# EasyEDA Pro project ASTROPET_SENSOR_SOURCE.epro, schematic sensor module
Board Name: outdoors; Create Date: 2026-06-01; Page Name: P1; Project Name: light pollution thingy; Schematic Name: sensor module; Update Date: 2026-06-05; Company: EasyEDA.com; Page Size: A4; Version: V1.0
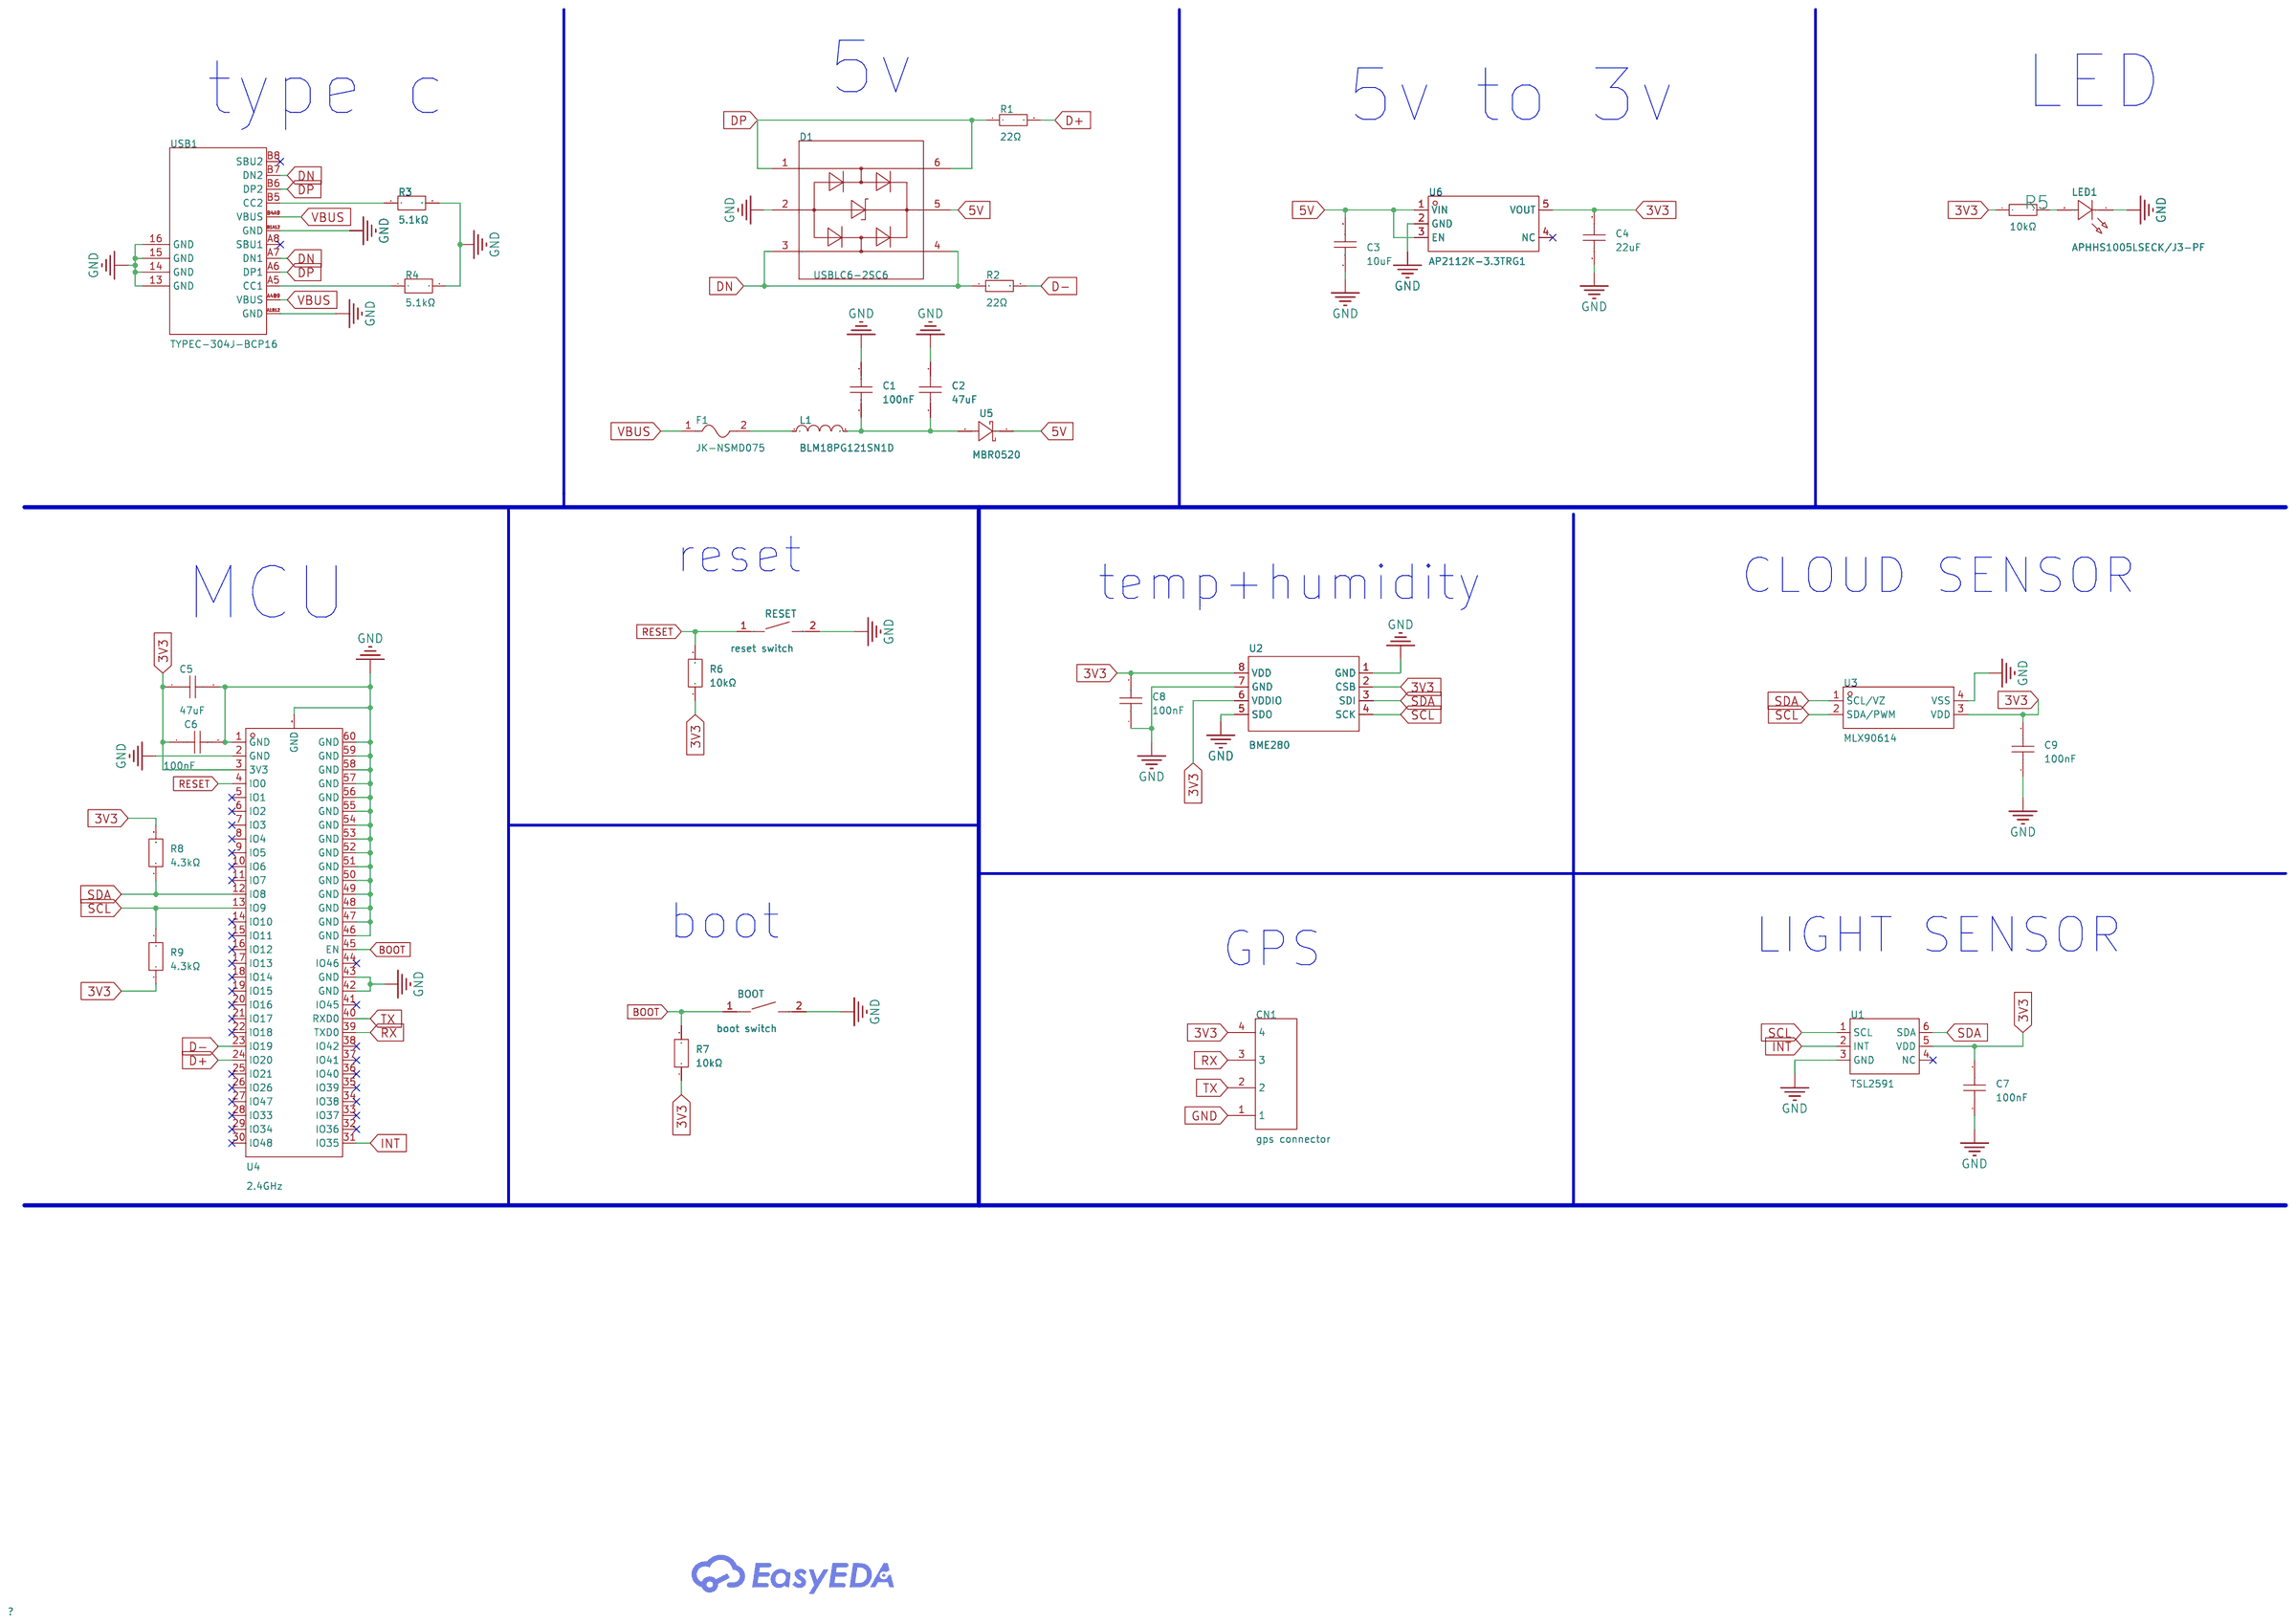
[diagram p1: schematic sheet]

## Parts
BOOT  boot switch  [SW-SMD_L3.9-W3.0-P4.45]
C1  100nF  [C0603]
C2  47uF  [C0805]
C3  10uF  [C0805]
C4  22uF  [C0805]
C5  47uF  [C0805]
C6  100nF  [C0603]
C7  100nF  [C0603]
C8  100nF  [C0603]
C9  100nF  [C0603]
CN1  gps connector  [CONN-TH_B4B-PH-K-S]
D1  USBLC6-2SC6  [SOT-23-6_L2.9-W1.6-P0.95-LS2.8-BL]
F1  JK-NSMD075  [F1206]
L1  BLM18PG121SN1D  [L0603]
LED1  APHHS1005LSECK/J3-PF  [LED0402-RD_RED]
R1  22Ω  [R0603]
R2  22Ω  [R0603]
R3  5.1kΩ  [R0603]
R4  5.1kΩ  [R0603]
R5  10kΩ  [R0603]
R6  10kΩ  [R0603]
R7  10kΩ  [R0603]
R8  4.3kΩ  [R0603]
R9  4.3kΩ  [R0603]
RESET  reset switch  [SW-SMD_L3.9-W3.0-P4.45]
U1  TSL2591  [DFN-6_L2.4-W2.0-P0.65-BL]
U2  BME280  [LGA-8_BME280_BL]
U3  MLX90614  [TO-39-4_MELEXIS_MLX90614XXA]
U4  2.4GHz  [BULETM-SMD_ESP32-S3-MINI-1-N8]
U5  MBR0520  [SOD-123_L2.7-W1.6-LS3.7-RD-A]
U6  AP2112K-3.3TRG1  [SOT-25-5_L2.9-W1.6-P0.95-LS2.8-BL]
USB1  TYPEC-304J-BCP16  [USB-C-SMD_TYPEC-304J-BCP16]

## Library data of the parts
BOOT RESET = TS-1088-AR02016: Circuit:SPST Actuator Style:Round Button Operating Force:1.6N Mounting Type:Surface Mount,Vertical Length:4mm Width:3mm Switch Height:2mm with Bracket:Without Bracket Contact Current:50mA Voltage Rating:12V Actuator/Cap Color:Black Termination Style:SMD(S; LCSC Part Name: 4*3*2mm 立贴 轻触开关; Supplier Part: C720477; Manufacturer: XUNPU(讯普); Supplier Footprint: SMD,4x3mm; JLCPCB Part Class: Basic Part; Datasheet: https://item.szlcsc.com/datasheet/TS-1088-AR02016/763484.html; Supplier: LCSC; Circuit: SPST; Actuator Style: Round Button; Operating Force: 1.6N; Mounting Type: Surface Mount,Vertical; Length: 4mm; Width: 3mm; Switch Height: 2mm; with Bracket: Without Bracket; Contact Current: 50mA; Voltage Rating: 12V; Actuator/Cap Color: Black; Termination Style: SMD(SMT) Tab; Life: 100,000 Cycles; Operating Temperature: -30℃~+80℃
C1 C6-C9 = CC0603KRX7R9BB104: Capacitance:100nF Tolerance:±10% Tolerance:±10% Voltage Rating:50V Temperature Coefficient:X7R; LCSC Part Name: 100nF ±10% 50V; Supplier Part: C14663; Manufacturer: YAGEO(国巨); Supplier Footprint: 0603; Datasheet: https://item.szlcsc.com/datasheet/CC0603KRX7R9BB104/15331.html; Supplier: LCSC; Tolerance: ±10%; Voltage Rating: 50V; Temperature Coefficient: X7R
C2 C5 = CGA0805X5R476M100MT: Capacitance:47uF Tolerance:±20% Tolerance:±20% Voltage Rating:10V Temperature Coefficient:X5R; LCSC Part Name: 47uF ±20% 10V; Supplier Part: C6119904; Manufacturer: HRE(芯声); Supplier Footprint: 0805; JLCPCB Part Class: Extended Part; Datasheet: https://item.szlcsc.com/datasheet/CGA0805X5R476M100MT/7062610.html; Supplier: LCSC; Tolerance: ±20%; Voltage Rating: 10V; Temperature Coefficient: X5R
C3 = CL21A106KAYNNNE_C15850: Capacitance:10uF Tolerance:±10% Tolerance:±10% Voltage Rating:25V Temperature Coefficient:X5R; LCSC Part Name: 10uF ±10% 25V; Supplier Part: C15850; Manufacturer: SAMSUNG(三星); Manufacturer Part: CL21A106KAYNNNE; Supplier Footprint: 0805; JLCPCB Part Class: Basic Part; Datasheet: https://item.szlcsc.com/datasheet/CL21A106KAYNNNE/16532.html; Supplier: LCSC; Tolerance: ±10%; Voltage Rating: 25V; Temperature Coefficient: X5R
C4 = CL21A226MQQNNNE: Capacitance:22uF Tolerance:±20% Tolerance:±20% Voltage Rating:6.3V Temperature Coefficient:X5R; LCSC Part Name: 22uF ±20% 6.3V; Supplier Part: C5674; Manufacturer: SAMSUNG(三星); Supplier Footprint: 0805; Datasheet: https://item.szlcsc.com/datasheet/CL21A226MQQNNNE/6133.html; Supplier: LCSC; Tolerance: ±20%; Voltage Rating: 6.3V; Temperature Coefficient: X5R
CN1 = B4B-PH-K-S(LF)(SN)_C131334: Pins Structure:1x4P Pitch:2mm Mounting Type:Through Hole Reference Series:PH Number of Pins:4P Number of Rows:1 Number of PINs Per Row:4 Row Spacing:- Current Rating:2A Contact Material:Brass Contact Plating:Tin Operating Temperature:-25℃~+85℃ Operating T; LCSC Part Name: 1x4P 间距:2mm 直插 系列:PH; Supplier Part: C131334; Manufacturer: JST; Supplier Footprint: 插件,P=2mm; Datasheet: https://item.szlcsc.com/datasheet/B4B-PH-K-S(LF)(SN)/142627.html; Supplier: LCSC; Pins Structure: 1x4P; Pitch: 2mm; Mounting Type: Through Hole; Reference Series: PH; Number of Pins: 4P; Number of Rows: 1; Number of PINs Per Row: 4; Current Rating: 2A; Contact Material: Brass; Contact Plating: Tin; Operating Temperature: -25℃~+85℃; Voltage Rating: 100V; Plastic Material: PA66; Flame Retardant Rating: UL94V-0; Supplementary Features: K Pin; Color: White; Z-Height of the Board: 6mm; X-Length of Bottom Edge on Board (Spacing Line): 9.9mm; Y-Width of Bottom Edge on Board: 4.5mm
D1 = USBLC6-2SC6_C7519: Polarity:Unidirectional Reverse Stand-Off Voltage (Vrwm):5.25V Clamping Voltage:17V Peak Pulse Current (Ipp):5A Voltage - Breakdown:6V Reverse Leakage Current (Ir):150nA Number of Channels:2 Operating Temperature:-40℃~+125℃ Operating Temperature:-40℃~+125; LCSC Part Name: 单向ESD; Supplier Part: C7519; Manufacturer: ST(意法半导体); Supplier Footprint: SOT-23-6L; Datasheet: https://item.szlcsc.com/datasheet/USBLC6-2SC6/7996.html; Supplier: LCSC; Polarity: Unidirectional; Reverse Stand-Off Voltage (Vrwm): 5.25V; Clamping Voltage: 17V; Peak Pulse Current (Ipp): 5A; Voltage - Breakdown: 6V; Reverse Leakage Current (Ir): 150nA; Number of Channels: 2; Operating Temperature: -40℃~+125℃; level of protection: IEC 61000-4-2; Type: ESD; Junction Capacitance: 3.5pF
F1 = JK-NSMD075: Voltage - Max:6V Current - Max:100A Hold Current:750mA Trip Current:1.5A Power Dissipation:- Resistance - Initial (Ri) (Min):90mΩ Resistance - Post Trip (R1) (Max):500mΩ Time to Trip(Max):200ms Operating Temperature:-40℃~+85℃ Operating Temperature:-40℃~+8; LCSC Part Name: 6V 750mA 1206自恢复; Supplier Part: C2830242; Manufacturer: JK(金科); Supplier Footprint: 1206; Datasheet: https://item.szlcsc.com/datasheet/JK-NSMD075/726297.html; Supplier: LCSC; Voltage - Max: 6V; Current - Max: 100A; Hold Current: 750mA; Trip Current: 1.5A; Resistance - Initial (Ri) (Min): 90mΩ; Resistance - Post Trip (R1) (Max): 500mΩ; Time to Trip(Max): 200ms; Operating Temperature: -40℃~+85℃; Length: 3.5mm; Width: 1.8mm; Height: 0.85mm
L1 = BLM18PG121SN1D_C14709: Impedance @ Frequency:120Ω@100MHz Tolerance:±25% Tolerance:±25% DC Resistance(DCR):50mΩ Current Rating:2A Number of Circuits:1 Operating Temperature:-55℃~+125℃ Operating Temperature:-55℃~+125℃; LCSC Part Name: 单路 0603磁珠 阻抗120Ω@100MHz; Supplier Part: C14709; Manufacturer: muRata(村田); Supplier Footprint: 0603; JLCPCB Part Class: Basic Part; Datasheet: https://item.szlcsc.com/datasheet/BLM18PG121SN1D/15379.html; Supplier: LCSC; Impedance @ Frequency: 120Ω@100MHz; Tolerance: ±25%; DC Resistance(DCR): 50mΩ; Current Rating: 2A; Number of Circuits: 1; Operating Temperature: -55℃~+125℃
LED1 = APHHS1005LSECK/J3-PF: Lamp Holder Type:- Illumination Color:Red Voltage - Forward(Vf):1.8V Voltage - Forward(Vf):1.8V Power(Watts):84mW Forward Current:2mA Wavelength - Dominant:625nm Wavelength - Dominant:625nm Peak Wavelength:640nm Diode Configuration:Discrete Diode Lens Col; LCSC Part Name: 1.0x0.5 mm贴片式芯片LED灯; Supplier Part: C5354976; Manufacturer: Kingbright(今台); Supplier Footprint: 0402; JLCPCB Part Class: Extended Part; Datasheet: https://item.szlcsc.com/datasheet/APHHS1005LSECK%252FJ3-PF/6154435.html; Supplier: LCSC; Illumination Color: Red; Voltage - Forward(Vf): 1.8V; Power(Watts): 84mW; Forward Current: 2mA; Wavelength - Dominant: 625nm; Peak Wavelength: 640nm; Diode Configuration: Discrete Diode; Lens Color: Water Clear; Luminous Intensity: 80mcd; Viewing Angle: 120°; Operating Temperature: -40℃~+85℃
R1 R2 = 0603WAF220JT5E: Type:Thick Film Resistors Resistance:22Ω Tolerance:±1% Tolerance:±1% Power(Watts): Overload Voltage (Max): Temperature Coefficient:±100ppm/℃ Temperature Coefficient:±100ppm/℃ Operating Temperature Range:-55℃~+155℃ Operating Temperature Range:-55℃~+155℃; LCSC Part Name: 22Ω ±1% 100mW 厚膜电阻; Supplier Part: C23345; Manufacturer: UNI-ROYAL(厚声); Supplier Footprint: 0603; JLCPCB Part Class: Basic Part; Datasheet: https://atta.szlcsc.com/upload/public/pdf/source/20200306/C422600_1E6D84923E4A46A82E41ADD87F860B5C.pdf; Supplier: LCSC; Type: Thick Film Resistors; Tolerance: ±1%; Temperature Coefficient: ±100ppm/℃; Operating Temperature Range: -55℃~+155℃
R3 R4 = FRC0603F5101TS: Type:Thick Film Resistor Resistance:5.1kΩ Tolerance:±1% Tolerance:±1% Power(Watts):100mW Voltage-Supply(Max):75V Temperature Coefficient:±100ppm/℃ Temperature Coefficient:±100ppm/℃ Operating Temperature:-55℃~+155℃ Operating Temperature:-55℃~+155℃; LCSC Part Name: 5.1kΩ ±1% 100mW 厚膜电阻; Supplier Part: C2907044; Manufacturer: FOJAN(富捷); Supplier Footprint: 0603; JLCPCB Part Class: Extended Part; Supplier: LCSC; Type: Thick Film Resistor; Tolerance: ±1%; Power(Watts): 100mW; Voltage-Supply(Max): 75V; Temperature Coefficient: ±100ppm/℃; Operating Temperature: -55℃~+155℃
R5 = 0603WAF1002T5E: Type:Thick Film Resistor Resistance:10kΩ Tolerance:±1% Tolerance:±1% Power(Watts):100mW Voltage-Supply(Max):75V Temperature Coefficient:±100ppm/℃ Temperature Coefficient:±100ppm/℃ Operating Temperature:-55℃~+155℃ Operating Temperature:-55℃~+155℃; LCSC Part Name: 厚膜电阻 10kΩ ±1% 100mW; Supplier Part: C25804; Manufacturer: UNI-ROYAL(厚声); Supplier Footprint: 0603; Datasheet: https://item.szlcsc.com/datasheet/0603WAF1002T5E/26547.html; Supplier: LCSC; Type: Thick Film Resistor; Tolerance: ±1%; Power(Watts): 100mW; Voltage-Supply(Max): 75V; Temperature Coefficient: ±100ppm/℃; Operating Temperature: -55℃~+155℃
R6 R7 = FRC0603J103 TS: Type:Thick Film Resistor Resistance:10kΩ Tolerance:±5% Tolerance:±5% Power(Watts):100mW Voltage-Supply(Max):75V Temperature Coefficient:±100ppm/℃ Temperature Coefficient:±100ppm/℃ Operating Temperature:-55℃~+155℃ Operating Temperature:-55℃~+155℃; LCSC Part Name: 10kΩ ±5% 100mW 厚膜电阻; Supplier Part: C2930027; Manufacturer: FOJAN(富捷); Supplier Footprint: 0603; JLCPCB Part Class: Extended Part; Datasheet: https://item.szlcsc.com/datasheet/FRC0603J103%2520TS/3266960.html; Supplier: LCSC; Type: Thick Film Resistor; Tolerance: ±5%; Power(Watts): 100mW; Voltage-Supply(Max): 75V; Temperature Coefficient: ±100ppm/℃; Operating Temperature: -55℃~+155℃
R8 R9 = FRC0603F4301TS: Type:Thick Film Resistor Resistance:4.3kΩ Tolerance:±1% Tolerance:±1% Power(Watts):100mW Voltage-Supply(Max):75V Temperature Coefficient:±100ppm/℃ Temperature Coefficient:±100ppm/℃ Operating Temperature:-55℃~+155℃ Operating Temperature:-55℃~+155℃; LCSC Part Name: 4.3kΩ ±1% 100mW 厚膜电阻; Supplier Part: C2930099; Manufacturer: FOJAN(富捷); Supplier Footprint: 0603; Supplier: LCSC; Type: Thick Film Resistor; Tolerance: ±1%; Power(Watts): 100mW; Voltage-Supply(Max): 75V; Temperature Coefficient: ±100ppm/℃; Operating Temperature: -55℃~+155℃
U1 = TSL25911FN: Measurement Type:Light Intensity Interface:I2C Voltage - Supply:2.7V~3.6V Voltage - Supply:2.7V~3.6V Quiescent Current:2.3uA Operating Temperature:-30℃~+70℃ Operating Temperature:-30℃~+70℃ Length:2.4mm Width:2mm Height:0.65mm Features:Spectral correction/; LCSC Part Name: 光数字转换器; Supplier Part: C176812; Manufacturer: ams(艾迈斯半导体); Supplier Footprint: DFN-6(2x2.2); Datasheet: https://item.szlcsc.com/datasheet/TSL25911FN/188203.html; Supplier: LCSC; Measurement Type: Light Intensity; Interface: I2C; Voltage - Supply: 2.7V~3.6V; Quiescent Current: 2.3uA; Operating Temperature: -30℃~+70℃; Length: 2.4mm; Width: 2mm; Height: 0.65mm; Features: Spectral correction/filtering；Low power/sleep mode；Adjustable gain control；Interrupt/event trigger
U2 = BME280: Temperature Range:-40℃~+85℃ Temperature Range:-40℃~+85℃ Humidity:0%RH~100%RH Humidity:0%RH~100%RH Interface:I2C；SPI Voltage - Supply:1.71V~3.6V Voltage - Supply:1.71V~3.6V Current - Supply:1.8uA Humidity Tolerance:±3%RH Humidity Tolerance:±3%RH Temperatur; LCSC Part Name: 湿度：0%RH~100%RH; Supplier Part: C92489; Manufacturer: Bosch(博世); Supplier Footprint: LGA-8(2.5x2.5); Datasheet: https://item.szlcsc.com/datasheet/BME280/93682.html; Supplier: LCSC; Temperature Range: -40℃~+85℃; Humidity: 0%RH~100%RH; Interface: I2C；SPI; Voltage - Supply: 1.71V~3.6V; Current - Supply: 1.8uA; Humidity Tolerance: ±3%RH; Temperature Tolerance: ±0.5℃; Resolution: 16bit
U3 = MLX90614ESF-BAA-000-TU: Detection Temperature Range:-40℃~+85℃ Detection Temperature Range:-40℃~+85℃ Tolerance:±0.5℃ Tolerance:±0.5℃ Voltage - Supply:2.6V~3.6V Voltage - Supply:2.6V~3.6V Standby Current:6uA Interface:SMBus Temperature Conversion Time:- Temperature Resolution:10bi; LCSC Part Name: TO-39封装的单区和双区红外温度计; Supplier Part: C490604; Manufacturer: Melexis(比利时迈来芯); Supplier Footprint: TO-39-4; Datasheet: https://item.szlcsc.com/datasheet/MLX90614ESF-BAA-000-TU/501015.html; Supplier: LCSC; Detection Temperature Range: -40℃~+85℃; Tolerance: ±0.5℃; Voltage - Supply: 2.6V~3.6V; Standby Current: 6uA; Interface: SMBus; Temperature Resolution: 10bit
U4 = ESP32-S3-MINI-1-N4R2: Utilized IC / Part:ESP32-S3 Wireless Standard:Bluetooth5.0 Interface Type:I2C；GPIO；UART；SPI；USB；I2S Frequency:2.4GHz Antenna Type:On-board PCB Antenna Output Power:20.5dBm Output Power:20.5dBm Voltage - Supply:3V~3.6V Voltage - Supply:3V~3.6V Receive  Cur; LCSC Part Name: 不带固件 小尺寸模组，集成2.4GHz Wi-Fi(802.11b/g/n)+Bluetooth 5(LE); Supplier Part: C3013941; Manufacturer: ESPRESSIF(乐鑫); Supplier Footprint: SMD; Datasheet: https://item.szlcsc.com/datasheet/ESP32-S3-MINI-1-N4R2/3522411.html; Supplier: LCSC; Utilized IC / Part: ESP32-S3; Wireless Standard: Bluetooth5.0; Interface Type: I2C；GPIO；UART；SPI；USB；I2S; Antenna Type: On-board PCB Antenna; Output Power: 20.5dBm; Voltage - Supply: 3V~3.6V; Receive  Current: 95mA; Send  Current: 355mA; Sensitivity: -103.5dBm; Operating Temperature: -40℃~+85℃
U5 = MBR0520_C5204745: Diode Configuration:Independent Voltage - Forward(Vf@If):440mV@0.5A Voltage - DC Reverse(Vr):20V Current - Rectified:500mA Reverse Leakage Current (Ir):150uA Non-Repetitive Peak Forward Surge Current:5.5A; LCSC Part Name: 电压:20V 电流:500mA; Supplier Part: C5204745; Manufacturer: TWGMC(迪嘉); Supplier Footprint: SOD-123; JLCPCB Part Class: Extended Part; Datasheet: https://item.szlcsc.com/datasheet/MBR0520/5894894.html; Supplier: LCSC; Diode Configuration: Independent; Voltage - Forward(Vf@If): 440mV@0.5A; Voltage - DC Reverse(Vr): 20V; Current - Rectified: 500mA; Reverse Leakage Current (Ir): 150uA; Non-Repetitive Peak Forward Surge Current: 5.5A
U6 = AP2112K-3.3TRG1: Output Type:Fixed Voltage - Supply:6V Output Voltage:3.3V Output Voltage:3.3V Output Current:600mA Power Supply Rejection Ratio (PSRR):65dB@(1kHz) Voltage Dropout:250mV@(600mA) standby current:55uA Noise:50uVrms Features:Enable；Over Temperature Protection; LCSC Part Name: 输入6V 输出3.3V 600mA; Supplier Part: C51118; Manufacturer: DIODES(美台); Supplier Footprint: SOT-25-5; JLCPCB Part Class: Extended Part; Datasheet: https://item.szlcsc.com/datasheet/AP2112K-3.3TRG1/52131.html; Supplier: LCSC; Output Type: Fixed; Voltage - Supply: 6V; Output Voltage: 3.3V; Output Current: 600mA; Power Supply Rejection Ratio (PSRR): 65dB@(1kHz); Voltage Dropout: 250mV@(600mA); standby current: 55uA; Noise: 50uVrms; Features: Enable；Over Temperature Protection；Over Current Protection; Operating Temperature: -40℃~+85℃@(Ta); Output Configuration: Positive; Number of Outputs: 1
USB1 = TYPEC-304J-BCP16: Connector Type:Type-C Protocol Standard:- Gender:Female Mounting Type:Surface Mount, Right Angle Number of Contacts:16P Number of Ports:1 Current Rating-Power:5A Voltage Rating:20V Connect-Disconnect Life:10,000 cycles Supplementary Features:- Center Heig; LCSC Part Name: Type-C 母 卧贴; Supplier Part: C2835315; Manufacturer: XUNPU(讯普); Supplier Footprint: SMD; JLCPCB Part Class: Extended Part; Datasheet: https://item.szlcsc.com/datasheet/TYPEC-304J-BCP16/2998973.html; Supplier: LCSC; Connector Type: Type-C; Gender: Female; Mounting Type: Surface Mount, Right Angle; Number of Contacts: 16P; Number of Ports: 1; Current Rating-Power: 5A; Voltage Rating: 20V; Connect-Disconnect Life: 10,000 cycles; Length: 7.35mm; Detection color: Black; Operating Temperature: -40℃~+85℃

## Nets
3V3: C4.2 C5.1 C6.1 C7.2 C8.2 C9.2 CN1.4 R5.1 R6.1 R7.1 R8.2 R9.1 U1.5(VDD) U2.2(CSB) U2.6(VDDIO) U2.8(VDD) U3.3(VDD) U4.3(3V3) U6.5(VOUT)
5V: C3.2 D1.5 U5.1(K) U6.1(VIN) U6.3(EN)
GND: BOOT.2 C1.2 C2.2 C3.1 C4.1 C5.2 C6.2 C7.1 C8.1 C9.1 CN1.1 D1.2 LED1.1(K) R3.2 R4.2 RESET.2 U1.3(GND) U2.1(GND) U2.5(SDO) U2.7(GND) U3.4(VSS) U4.1(GND) U4.2(GND) U4.42(GND) U4.43(GND) U4.46(GND) U4.47(GND) U4.48(GND) U4.49(GND) U4.50(GND) U4.51(GND) U4.52(GND) U4.53(GND) U4.54(GND) U4.55(GND) U4.56(GND) U4.57(GND) U4.58(GND) U4.59(GND) U4.60(GND) U4.GND U6.2(GND) USB1.13(GND) USB1.14(GND) USB1.15(GND) USB1.16(GND) USB1.A1B12(GND) USB1.B1A12(GND)
VBUS: F1.1 USB1.A4B9(VBUS) USB1.B4A9(VBUS)
BOOT: BOOT.1 R7.2 U4.45(EN)
D+: R1.2 U4.24(IO20)
D-: R2.2 U4.23(IO19)
DN: D1.3 D1.4 R2.1 USB1.A7(DN1) USB1.B7(DN2)
DP: D1.1 D1.6 R1.1 USB1.A6(DP1) USB1.B6(DP2)
INT: U1.2(INT) U4.31(IO35)
RESET: R6.2 RESET.1 U4.4(IO0)
RX: CN1.3 U4.39(TXD0)
SCL: R9.2 U1.1(SCL) U2.4(SCK) U3.2(SDA/PWM) U4.13(IO9)
SDA: R8.1 U1.6(SDA) U2.3(SDI) U3.1(SCL/VZ) U4.12(IO8)
TX: CN1.2 U4.40(RXD0)
$1N6486: R3.1 USB1.B5(CC2)
$1N6491: R4.1 USB1.A5(CC1)
$1N6871: F1.2 L1.1
$1N6907: C1.1 C2.1 L1.2 U5.2(A)
$1N7993: LED1.2(A) R5.2

Not connected (* = marked no-connect by the designer): U1 4(NC)*; U4 5(IO1)* 6(IO2)* 7(IO3)* 8(IO4)* 9(IO5)* 10(IO6)* 11(IO7)* 14(IO10)* 15(IO11)* 16(IO12)* 17(IO13)* 18(IO14)* 19(IO15)* 20(IO16)* 21(IO17)* 22(IO18)* 25(IO21)* 26(IO26)* 27(IO47)* 28(IO33)* 29(IO34)* 30(IO48)* 32(IO36)* 33(IO37)* 34(IO38)* 35(IO39)* 36(IO40)* 37(IO41)* 38(IO42)* 41(IO45)* 44(IO46)*; U6 4(NC)*; USB1 A8(SBU1)* B8(SBU2)*

## Notes on the sheet
- 5v
- LED
- type c
- 5v to 3v
- reset
- temp+humidity
- CLOUD SENSOR
- MCU
- boot
- LIGHT SENSOR
- GPS
